# EAGLE design ws2812b-Breakout (EAGLE 7.2.0)
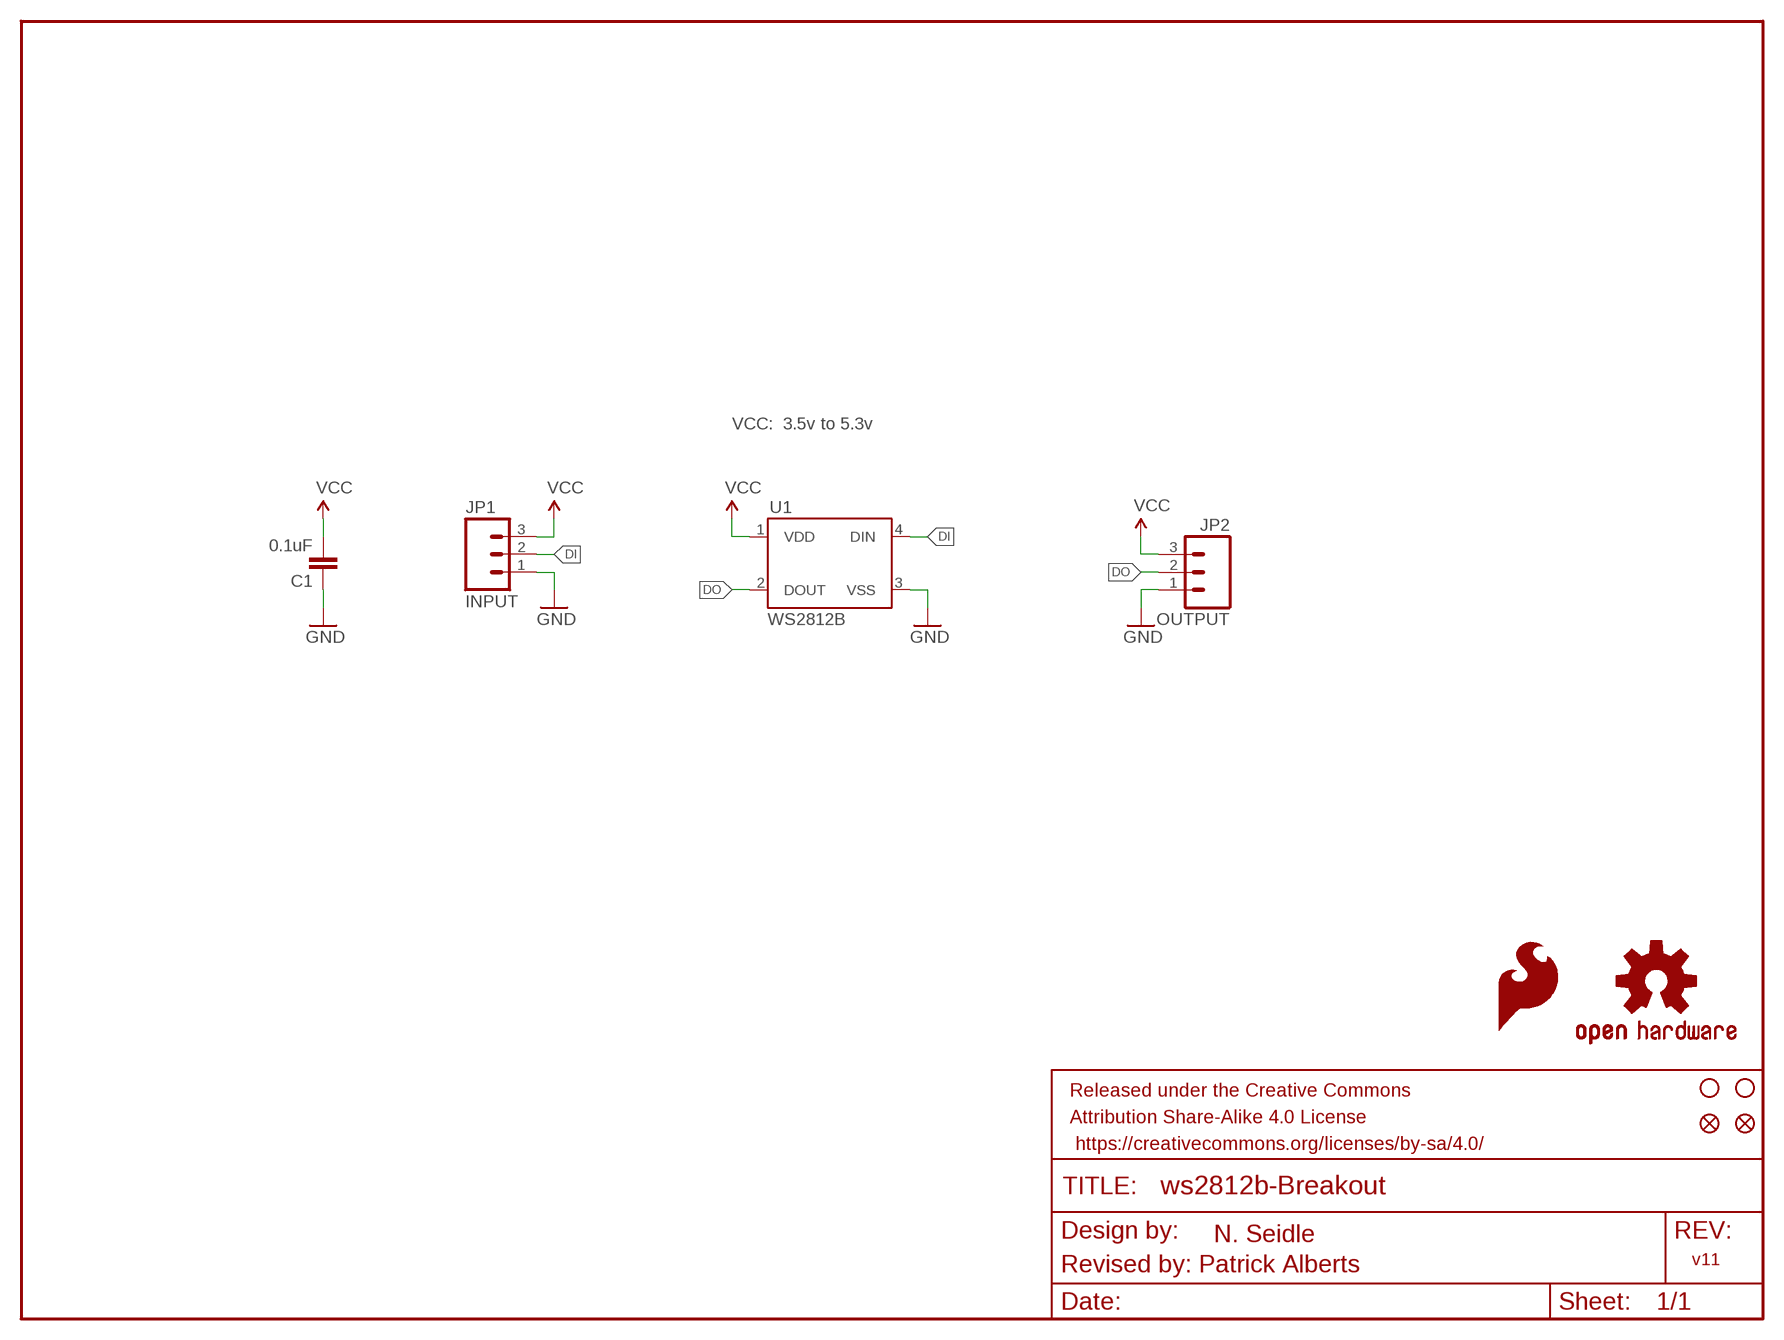
[diagram p0: schematic, sheet 1]

## Parts
C1  0.1uF  0.1UF-25V(+80/-20%)(0603)  [0603-CAP]
FID1  FIDUCIALUFIDUCIAL  [MICRO-FIDUCIAL]
FID2  FIDUCIALUFIDUCIAL  [MICRO-FIDUCIAL]
FRAME1  FRAME-LETTER  [CREATIVE_COMMONS]
JP1  INPUT  M03PTH  [1X03]
JP2  OUTPUT  M03PTH  [1X03]
JP4  STAND-OFF  [STAND-OFF]
JP15  STAND-OFF  [STAND-OFF]
LOGO1  OSHW-LOGOS  [OSHW-LOGO-S]
LOGO2  SFE_LOGO_FLAME.1_INCH  [SFE_LOGO_FLAME_.1]
U1  WS2812B  [WS2812B]

## Nets
DI: JP1.2 U1.4(DIN)
DO: JP2.2 U1.2(DOUT)
GND: C1.1 JP1.1 JP2.1 U1.3(VSS)
VCC: C1.2 JP1.3 JP2.3 U1.1(VDD)

## Notes on the sheet
- VCC:  3.5v to 5.3v
- N. Seidle
- v11
- Revised by: Patrick Alberts

## Library data of the parts
C1 = SparkFun-Capacitors:0.1UF-25V(+80/-20%)(0603): CAP-00810 Ceramic Standard decoupling cap; PROD_ID: CAP-00810
FID1 FID2 = SparkFun-Aesthetics:FIDUCIAL: Fiducial Alignment Points Various fiducial points for machine vision alignment.
FRAME1 = SparkFun-Aesthetics:FRAME-LETTER: Schematic Frame Standard 8.5x11 US Letter frame; DESIGNER: NAME; VERSION: v01
JP1 JP2 = SparkFun-Connectors:M03: Header 3 Standard 3-pin 0.1" header. Use with straight break away headers (SKU : PRT-00116), right angle break away headers (PRT-00553), swiss pins (PRT-00743), machine pins (PRT-00117), and female headers (PRT-00115). Molex polarized connector foot print use with SKU : PRT-08232 with associated crimp pins and housings.
JP4 JP15 = SparkFun:STAND-OFF: Stand Off This is the mechanical footprint for a #4 phillips button head screw. Use the keepout ring to avoid running the screw head into surrounding components. SKU : PRT-00447
LOGO1 = SparkFun-Aesthetics:OSHW-LOGO: Open Source Hardware Logo This logo indicates the piece of hardware it is found on incorporates a OSHW license and/or adheres to the definition of open source hardware found here: http://freedomdefined.org/OSHW
LOGO2 = SparkFun-Aesthetics:SFE_LOGO_FLAME: SFE Logo, flame only This is the SparkFun flame logo. The logo on the schematic will always be the same size; the package variant is the height of the flame. Default layer for the logo on the board is tSilk.
U1 = SparkFun-LED:WS2812B: WS2812B - Intelligent control LED integrated light source Technical Specifications: Power Supply Voltage (VDD): 3.5 to 5.3 V Input Voltage (VI): -0.5 to VDD+0.5 V Operating Junction Temperature (Topt): -25°C to +80°C Storage Temperature Range (Tstg): -55°C to +150°C; PROD_ID: DIO-12503

## Board
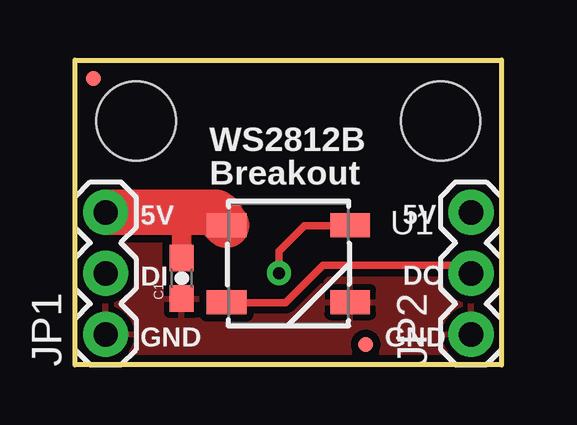
[diagram p1: board, top side]
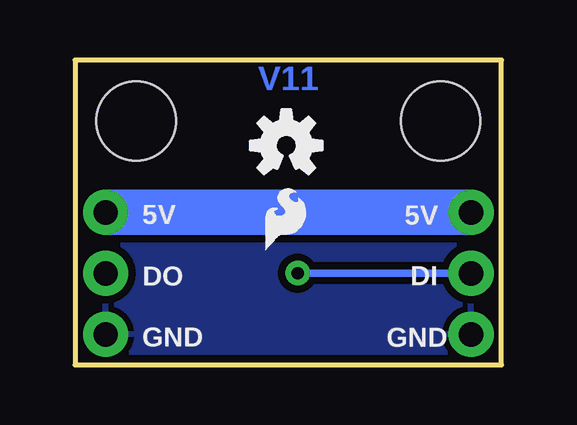
[diagram p2: board, bottom side, seen from below]

Size 17.78 x 12.7 mm. Coordinates in mm from the lower left corner, seen from the top.
Outline: 0,0 0,12.7 17.78,12.7 17.78,0 0,0
Copper layers (1*16): Top 0.035mm / dielectric 1.5mm / Bottom 0.035mm
Design rules "SparkFun-2-layer": minimum track width 7mil, minimum drill 15mil, track to track 8mil, track to pad 8mil, pad to pad 8mil, via to via 8mil, smd to smd 8mil, copper to edge 8mil, drill to drill 8mil, minimum pad ring 12mil, minimum via ring 10mil, stop-mask expansion 4mil, vias tented up to drill 20mil, thermal gap 10mil

### Footprints (pad centres in the part's own frame; a part is rotated, then mirrored left to right if it is on the bottom)
0603-CAP = smd 1.1 x 1: 1 -0.85,0; 2 0.85,0
MICRO-FIDUCIAL = smd 0.635 x 0.635: 1 0,0
1X03 = drill 1.016 pad 1.88: 1 0,0; 2 2.54,0; 3 5.08,0
STAND-OFF = hole 3.302: 0,0
WS2812B = smd 1.651 x 1: 1 -2.577,1.6; 2 -2.577,-1.6; 3 2.577,-1.6; 4 2.577,1.6

### Placement (x,y rotation side)
C1  4.45,3.61 90 top
FID1  0.76,11.94 0 top
FID2  12.12,0.85 0 top
FRAME1  -21.45,-12.7 0 top  (outside the outline)
JP1  1.27,1.27 90 top
JP2  16.51,1.27 90 top
JP4  2.54,10.16 0 top
JP15  15.24,10.16 0 top
LOGO1  8.98,9.14 0 bottom
LOGO2  10.16,4.44 0 bottom
U1  8.89,4.22 0 top

### Tracks (layer width: path | path; a pad name or v marks a point on that pad's centre or on a via)
DI  (via drill 0.51)
  Top 0.305: v8.5,3.82 8.5,4.73 9.56,5.79 11.44,5.79 U1.4
  Bottom 0.305: JP1.2 v8.5,3.82
DO
  Top 0.305: JP2.2 16.17,4.15 10.34,4.15 8.78,2.59 6.34,2.59 U1.2
GND
  pour Top (isolate 0.305): 0,7.62 0,0 17.78,0 17.78,7.62
  pour Bottom (isolate 0.305): 0,7.62 0,0 17.78,0 17.78,7.62
VCC
  Top 0.813: 4.57,5.97 4.7,5.97 | 4.7,5.97 5.08,6.35 | C1.2 4.45,5.71 4.7,5.97
  Top 1.905: JP1.3 5.08,6.35 5.88,6.35 5.88,6.22 6.06,6.22 6.06,6.07 U1.1
  Bottom 1.905: JP2.3 JP1.3

### Text on the board
Bottom: V11
tPlace: WS2812B | Breakout | 5V | 5V | DI | DO | GND | GND
bPlace: 5V | 5V | DI | DO | GND | GND
Document: N. Seidle
tDocu: N. Seidle | Revised by: Patrick Alberts